# Altium schematic sheet MA2400_P2_MODUAL.SchDoc
size A4
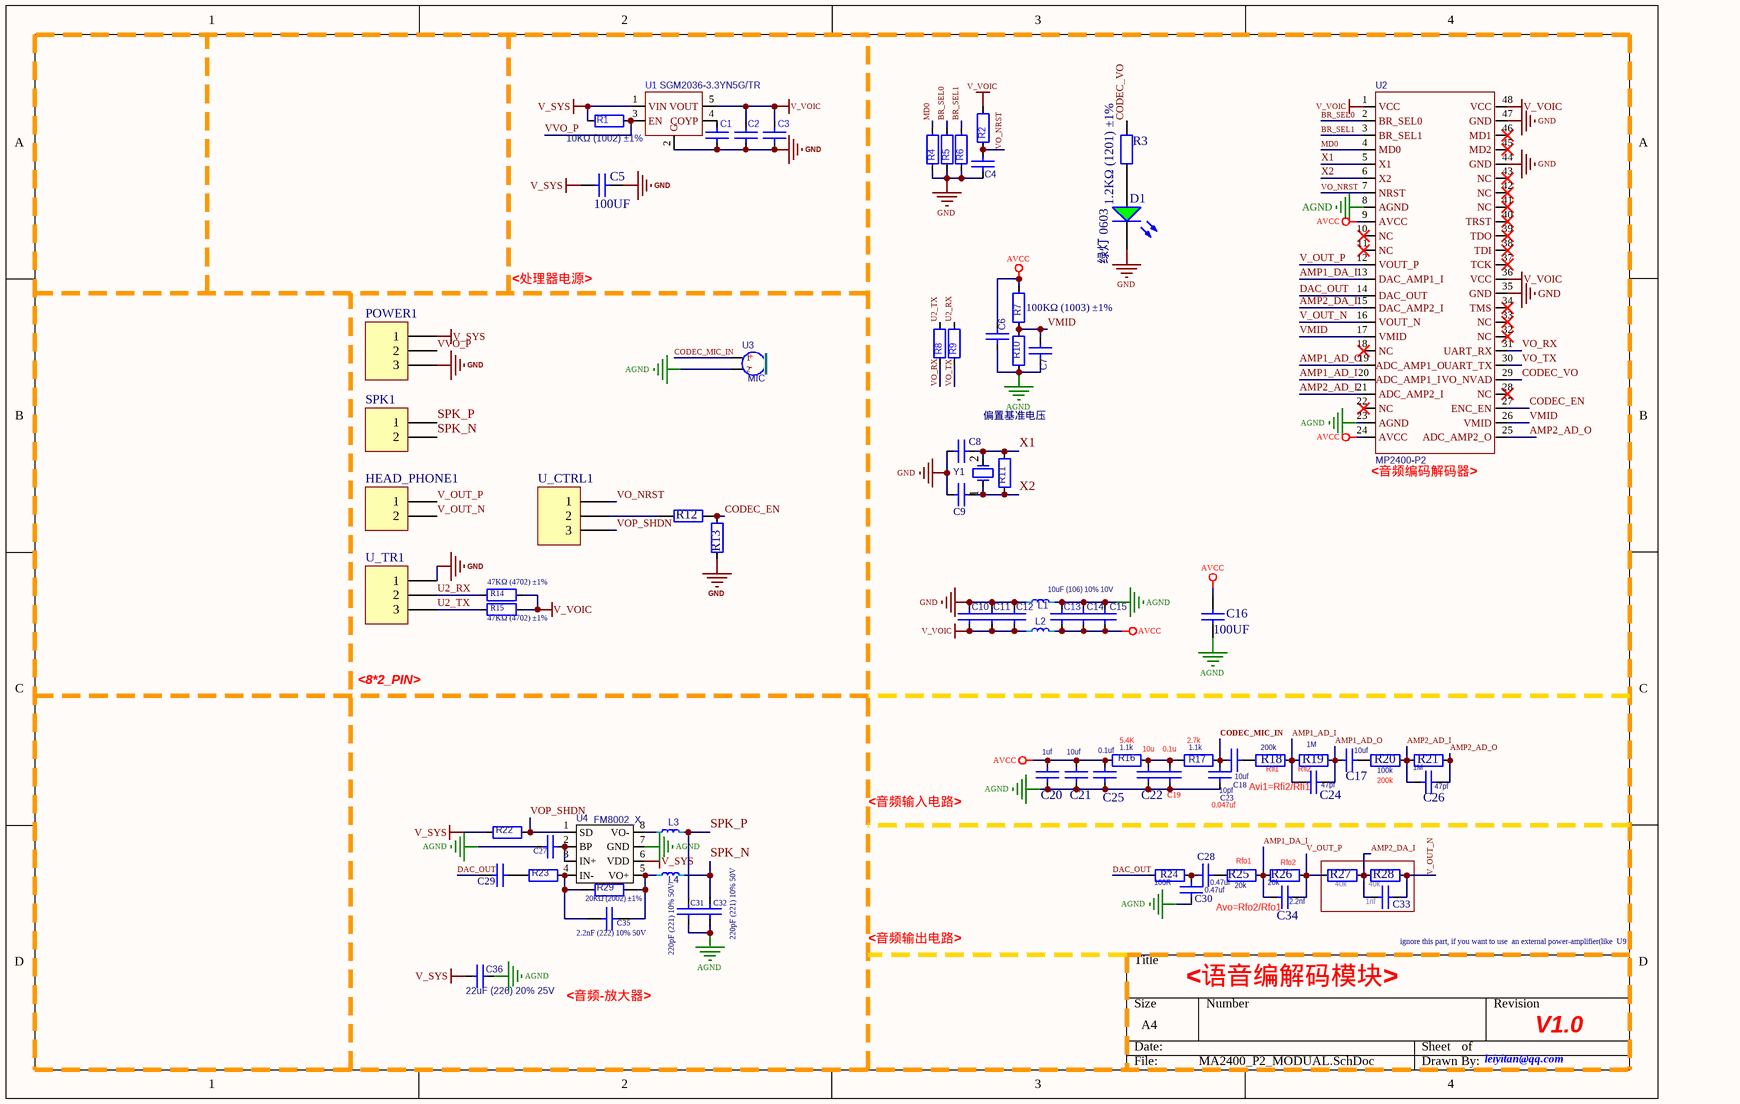
[diagram p0: MA2400_P2_MODUAL.SchDoc]

## Parts
C1  100nF (104) 10% 16V  [0402_C]  (value not drawn)
C2  100nF (104) 10% 16V  [0402_C]  (value not drawn)
C3  10uF (106) 10% 10V  [0603_C]  (value not drawn)
C4  10uF (106) 20% 6.3V  [0402_C]  (value not drawn)
C5  100UF  [C1210]
C6  1.0uF (105) 10% 25V  [0402_C]  (value not drawn)
C7  1.0uF (105) 10% 25V  [0402_C]  (value not drawn)
C8  12pF (120) 5% 50V  [0603_C]  (value not drawn)
C9  12pF (120) 5% 50V  [0603_C]  (value not drawn)
C10  100nF (104) 10% 16V  [0402_C]  (value not drawn)
C11  100nF (104) 10% 16V  [0402_C]  (value not drawn)
C12  100nF (104) 10% 16V  [0402_C]  (value not drawn)
C13  10uF (106) 10% 10V  [0603_C]
C14  100nF (104) 10% 16V  [0402_C]  (value not drawn)
C15  100nF (104) 10% 16V  [0402_C]  (value not drawn)
C16  100UF  [C1210]
C17  10uF (106) 10% 25V  [0805_C]  (value not drawn)
C18  10uF (106) 10% 25V  [0805_C]  (value not drawn)
C19  47nF (473) 10% 50V  [0805_C]  (value not drawn)
C20  1uF (105) 10% 50V  [0805_C]  (value not drawn)
C21  10uF (106) 10% 25V  [0805_C]  (value not drawn)
C22  47nF (473) 10% 50V  [0805_C]  (value not drawn)
C23  10pF (100) 5% 50V  [0603_C]  (value not drawn)
C24  47pF (470) 5% 50V  [0805_C]  (value not drawn)
C25  100nF(104) 10% 50V  [0805_C]  (value not drawn)
C26  47pF (470) 5% 50V  [0805_C]  (value not drawn)
C27  1uF (105) 10% 50V  [0805_C]  (value not drawn)
C28  470nF (474) 10% 50V  [0805_C]  (value not drawn)
C29  470nF (474) 10% 50V  [0805_C]  (value not drawn)
C30  470nF (474) 10% 50V  [0805_C]  (value not drawn)
C31  220pF (221) 10% 50V  [0402_C]
C32  220pF (221) 10% 50V  [0402_C]
C33  1nF (102) 10% 50V  [0805_C]  (value not drawn)
C34  2.2nF (222) 5% 50V  [0805_C]  (value not drawn)
C35  2.2nF (222) 10% 50V  [0603_C]
C36  22uF (226) 20% 25V  [0805_C]
D1  绿灯 0603  [0603_LED_S1]
HEAD_PHONE1  (no value)  [HDR1X2]
L1  10uH ±10%  [0603_L]  (value not drawn)
L2  10uH ±10%  [0603_L]  (value not drawn)
L3  10uH ±10%  [0603_L]  (value not drawn)
L4  10uH ±10%  [0603_L]  (value not drawn)
POWER1  (no value)  [HDR1X3]
R1  10KΩ (1002) ±1%  [0402_R]
R2  10KΩ (1002) ±1%  [0402_R]  (value not drawn)
R3  1.2KΩ (1201) ±1%  [0402_R]
R4  10KΩ (1002) ±1%  [0402_R]  (value not drawn)
R5  10KΩ (1002) ±1%  [0402_R]  (value not drawn)
R6  10KΩ (1002) ±1%  [0402_R]  (value not drawn)
R7  100KΩ (1003) ±1%  [0402_R]
R8  10KΩ (1002) ±1%  [0402_R]  (value not drawn)
R9  10KΩ (1002) ±1%  [0402_R]  (value not drawn)
R10  100KΩ (1003) ±1%  [0402_R]  (value not drawn)
R11  1MΩ (1004) ±1%  [0402_R]  (value not drawn)
R12  1KΩ (1001) ±1%  [0402_R]  (value not drawn)
R13  10KΩ (1002) ±1%  [0402_R]  (value not drawn)
R14  47KΩ (4702) ±1%  [0402_R]
R15  47KΩ (4702) ±1%  [0402_R]
R16  1.1KΩ (1101) ±1%  [0603_R]  (value not drawn)
R17  1.1KΩ (1101) ±1%  [0603_R]  (value not drawn)
R18  200KΩ (2003) ±1%  [0805_R]  (value not drawn)
R19  1MΩ (1004) ±1%  [0805_R]  (value not drawn)
R20  100KΩ (1003) ±1%  [0805_R]  (value not drawn)
R21  1MΩ (1004) ±1%  [0805_R]  (value not drawn)
R22  10KΩ (1002) ±1%  [0402_R]  (value not drawn)
R23  20KΩ (2002) ±1%  [0402_R]  (value not drawn)
R24  100Ω (1000) ±1%  [0805_R]  (value not drawn)
R25  20KΩ (2002) ±1%  [0805_R]  (value not drawn)
R26  20KΩ (2002) ±1%  [0805_R]  (value not drawn)
R27  40.2KΩ (4022) ±1%  [0805_R]  (value not drawn)
R28  40.2KΩ (4022) ±1%  [0805_R]  (value not drawn)
R29  20KΩ (2002) ±1%  [0402_R]
SPK1  (no value)  [HDR1X2]
U1  SGM2036-3.3YN5G/TR  [SOT23-5]
U2  MP2400-P2  [LQFP-48_7x7x05P]
U3  MIC  [6022_MIC]
U4  FM8002_X  [SOP-8_150mil]
U_CTRL1  (no value)  [HDR1X3]
U_TR1  (no value)  [HDR1X3]
Y1  8MHz ±20ppm 20pF  [SMD-5032_2P]  (value not drawn)

## Nets
AGND: C6.1 C7.1 C13.2 C14.2 C15.2 C16.1 C19.1 C20.1 C21.1 C22.1 C23.1 C25.1 C27.1 C30.1 C31.1 C32.1 C36.2 L1.1 R10.1 U2.8(AGND) U2.23(AGND) U3.2 U4.7(GND)
AVCC: C6.2 C13.1 C14.1 C15.1 C16.2 C20.2 C21.2 C25.2 L2.1 R7.2 R16.1 U2.9(AVCC) U2.24(AVCC)
GND: C1.1 C2.1 C3.1 C4.1 C5.2 C8.1 C9.2 C10.2 C11.2 C12.2 D1.K L1.2 POWER1.3 R4.1 R5.1 R6.1 R13.2 U1.2(G) U2.35(GND) U2.44(GND) U2.47(GND) U_TR1.1
V_SYS: C5.1 C36.1 POWER1.1 R1.1 R22.1 U1.1(VIN) U4.6(VDD)
V_VOIC: C2.2 C3.2 C10.1 C11.1 C12.1 L2.2 R2.2 R14.2 R15.2 U1.5(VOUT) U2.1(VCC) U2.36(VCC) U2.48(VCC)
AMP1_AD_I: C24.1 R18.2 R19.1 U2.20(ADC_AMP1_I)
AMP1_AD_O: C17.2 C24.2 R19.2 U2.19(ADC_AMP1_O)
AMP1_DA_I: C34.2 R25.2 R26.1 U2.13(DAC_AMP1_I)
AMP2_AD_I: C26.1 R20.2 R21.1 U2.21(ADC_AMP2_I)
AMP2_AD_O: C26.2 R21.2 U2.25(ADC_AMP2_O)
AMP2_DA_I: C33.1 R27.2 R28.1 U2.15(DAC_AMP2_I)
BR_SEL0: R5.2 U2.2(BR_SEL0)
BR_SEL1: R6.2 U2.3(BR_SEL1)
CODEC_EN: R12.2 R13.1 U2.27(ENC_EN)
CODEC_MIC_IN: C18.2 C23.2 R17.2 U3.1
CODEC_VO: R3.2 U2.29(VO_NVAD)
DAC_OUT: C29.1 R24.1 U2.14(DAC_OUT)
MD0: R4.2 U2.4(MD0)
SPK_N: C32.2 L4.1 SPK1.2
SPK_P: C31.2 L3.1 SPK1.1
U2_RX: R9.2 R14.1 U_TR1.2
U2_TX: R8.2 R15.1 U_TR1.3
V_OUT_N: C33.2 HEAD_PHONE1.2 R28.2 U2.16(VOUT_N)
V_OUT_P: C34.1 HEAD_PHONE1.1 R26.2 R27.1 U2.12(VOUT_P)
VMID: C7.2 R7.1 R10.2 U2.17(VMID) U2.26(VMID)
VO_NRST: C4.2 R2.1 U2.7(NRST) U_CTRL1.1
VO_RX: R8.1 U2.31(UART_RX)
VO_TX: R9.1 U2.30(UART_TX)
VOP_SHDN: R22.2 U4.1(SD) U_CTRL1.3
VVO_P: POWER1.2 R1.2 U1.3(EN)
X1: C8.2 R11.2 U2.5(X1) Y1.2(OSC2)
X2: C9.1 R11.1 U2.6(X2) Y1.1(OSC1)
NetC1_2: C1.2 U1.4(COYP)
NetC17_1: C17.1 R20.1
NetC18_1: C18.1 R18.1
NetC19_2: C19.2 C22.2 R16.2 R17.1
NetC27_2: C27.2 U4.2(BP) U4.3(IN+)
NetC28_1: C28.1 C30.2 R24.2
NetC28_2: C28.2 R25.1
NetC29_2: C29.2 R23.1
NetC35_1: C35.1 R23.2 R29.1 U4.4(IN-)
NetC35_2: C35.2 L4.2 R29.2 U4.5(VO+)
NetD1_A: D1.A R3.1
NetL3_2: L3.2 U4.8(VO-)
NetR12_1: R12.1 U_CTRL1.2

Not connected (* = marked no-connect by the designer): U2 10(NC)* 11(NC)* 18(NC)* 22(NC)* 28(NC)* 32(NC)* 33(NC)* 34(TMS)* 37(TCK)* 38(TDI)* 39(TDO)* 40(TRST)* 41(NC)* 42(NC)* 43(NC)* 45(MD2)* 46(MD1)*

## Notes on the sheet
- <处理器电源>
- 偏置基准电压
- (near U2) <音频编码解码器>
- <8*2_PIN>
- (near C20) 1uf
- (near C21) 10uf
- (near R16) 0.1uf
- (near R16) 1.1k
- 5.4K
- 10u
- 0.1u
- (near R17) 2.7k
- (near R17) 1.1k
- (near R18) 200k
- (near R19) 1M
- 10uf
- 1M
- <音频输入电路>
- (near C23) 0.047uf
- (near C23) 10pf
- (near C24) Avi1=Rfi2/Rfi1
- (near R18) Rfi1
- Rfi2
- (near C24) 47pf
- (near R20) 100k
- 200k
- (near C26) 47pf
- (near R24) 100R
- 0.47uf
- (near C34) Avo=Rfo2/Rfo1
- (near R25) 20k
- (near R25) Rfo1
- 20k
- (near R26) Rfo2
- (near C34) 2.2nf
- (near R27) 40k
- (near C33) 1nf
- 40k
- <音频输出电路>
- ignore this part, if you want to use  an external power-amplifier(like  U9
- <音频-放大器>
- <语音编解码模块>
- V1.0
- leiyitan@qq.com
- (in symbol MIC) +; -

## Library data of the parts
C1 C2 C10-C12 C14 C15 = 0402 100nF (104) 10% 16V: 贴片电容; ComponentLink1Description: 供应商链接; ComponentLink1URL: http://www.szlcsc.com/product/details_1877.html; Package: 0402; Supplier: LC; SuppliersPartNumber: C1525
C3 C13 = 0603 10uF (106) 10% 10V: 贴片电容; ComponentLink1Description: 供应商链接; ComponentLink1URL: http://www.szlcsc.com/product/details_20411.html; Package: 0603; Supplier: LC; SuppliersPartNumber: C19702
C4 = 0402 10uF (106) 20% 6.3V: 贴片电容; ComponentLink1Description: 供应商链接; ComponentLink1URL: http://www.szlcsc.com/product/details_16204.html; Package: 0402; Supplier: LC; SuppliersPartNumber: C15525
C5 C16 = 1206 10uF (106) 10% 50V: 贴片钽电容
C6 C7 = 0402 1.0uF (105) 10% 25V: 贴片电容; ComponentLink1Description: 供应商链接; ComponentLink1URL: http://www.szlcsc.com/product/details_53938.html; Package: 0402; Supplier: LC; SuppliersPartNumber: C52923
C8 C9 = 0603 12pF (120) 5% 50V: 贴片电容; ComponentLink1Description: 供应商链接; ComponentLink1URL: http://www.szlcsc.com/product/details_39506.html; Package: 0603; Supplier: LC; SuppliersPartNumber: C38523
C17 C18 C21 = 0805 10uF (106) 10% 25V: 贴片电容; ComponentLink1Description: 供应商链接; ComponentLink1URL: http://www.szlcsc.com/product/details_16532.html; Package: 0805; Supplier: LC; SuppliersPartNumber: C15850
C19 C22 = 0805 47nF (473) 10% 50V: 贴片电容; ComponentLink1Description: 供应商链接; ComponentLink1URL: http://www.szlcsc.com/product/details_54150.html; Package: 0805; Supplier: LC; SuppliersPartNumber: C53134
C20 C27 = 0805 1uF (105) 10% 50V: 贴片电容; ComponentLink1Description: 供应商链接; ComponentLink1URL: http://www.szlcsc.com/product/details_29074.html; Package: 0805; Supplier: LC; SuppliersPartNumber: C28323
C23 = 0603 10pF (100) 5% 50V: 贴片电容; ComponentLink1Description: 供应商链接; ComponentLink1URL: http://www.szlcsc.com/product/details_1986.html; Package: 0603; Supplier: LC; SuppliersPartNumber: C1634
C24 C26 = 0805 47pF (470) 5% 50V: 贴片电容; ComponentLink1Description: 供应商链接; ComponentLink1URL: http://www.szlcsc.com/product/details_15529.html; Package: 0805; Supplier: LC; SuppliersPartNumber: C14857
C25 = 0805 100nF(104) 10% 50V: 贴片电容; ComponentLink1Description: 供应商链接; ComponentLink1URL: http://www.szlcsc.com/product/details_50686.html; Package: 0805; Supplier: LC; SuppliersPartNumber: C49678
C28-C30 = 0805 470nF (474) 10% 50V: 贴片电容; ComponentLink1Description: 供应商链接; ComponentLink1URL: http://www.szlcsc.com/product/details_14623.html; Package: 0805; Supplier: LC; SuppliersPartNumber: C13967
C31 C32 = 0402 220pF (221) 10% 50V: 贴片电容; ComponentLink1Description: 供应商链接; ComponentLink1URL: http://www.szlcsc.com/product/details_1882.html; Package: 0402; Supplier: LC; SuppliersPartNumber: C1530
C33 = 0805 1nF (102) 10% 50V: 贴片电容; ComponentLink1Description: 供应商链接; ComponentLink1URL: http://www.szlcsc.com/product/details_52223.html; Package: 0805; Supplier: LC; SuppliersPartNumber: C51210
C34 = 0805 2.2nF (222) 5% 50V: 贴片电容; ComponentLink1Description: 供应商链接; ComponentLink1URL: http://www.szlcsc.com/product/details_29010.html; Package: 0805; Supplier: LC; SuppliersPartNumber: C28260
C35 = 0603 2.2nF (222) 10% 50V: 贴片电容; ComponentLink1Description: 供应商链接; ComponentLink1URL: http://www.szlcsc.com/product/details_1956.html; Package: 0603; Supplier: LC; SuppliersPartNumber: C1604
C36 = 0805 22uF (226) 20% 25V: 贴片电容; ComponentLink1Description: 供应商链接; ComponentLink1URL: http://www.szlcsc.com/product/details_46786.html; Package: 0805; Supplier: LC; SuppliersPartNumber: C45783
D1 = 0603 绿灯: 发光二极管; ComponentLink1Description: 供应商链接; ComponentLink1URL: http://www.szlcsc.com/product/details_73152.html; Package: 0603; Supplier: LC; SuppliersPartNumber: C72043
HEAD_PHONE1 SPK1 = Header 2: Header, 2-Pin; LatestRevisionDate: 17-Jul-2002; LatestRevisionNote: Re-released for DXP Platform.; Publisher: Altium Limited
L1-L4 = BEAD: 贴片电感; ComponentLink1Description: 供应商链接; ComponentLink1URL: http://www.szlcsc.com/product/details_1387.html; Package: 0603; Supplier: LC; SuppliersPartNumber: C1035
POWER1 U_CTRL1 U_TR1 = Header 3: Header, 3-Pin; LatestRevisionDate: 17-Jul-2002; LatestRevisionNote: Re-released for DXP Platform.; Publisher: Altium Limited
R1 R2 R4-R6 R8 R9 R13 R22 = 0402 10KΩ (1002) 1%: 贴片电阻; ComponentLink1Description: 供应商链接; ComponentLink1URL: http://www.szlcsc.com/product/details_26487.html; Package: 0402; Supplier: LC; SuppliersPartNumber: C25744
R3 = 0402 1.2KΩ (1201) 1%: 贴片电阻; ComponentLink1Description: 供应商链接; ComponentLink1URL: http://www.szlcsc.com/product/details_26605.html; Package: 0402; Supplier: LC; SuppliersPartNumber: C25862
R7 R10 = 0402 100KΩ (1003) 1%: 贴片电阻; ComponentLink1Description: 供应商链接; ComponentLink1URL: http://www.szlcsc.com/product/details_26484.html; Package: 0402; Supplier: LC; SuppliersPartNumber: C25741
R11 = 0402 1MΩ (1004) 1%: 贴片电阻; ComponentLink1Description: 供应商链接; ComponentLink1URL: http://www.szlcsc.com/product/details_26826.html; Package: 0402; Supplier: LC; SuppliersPartNumber: C26083
R12 = 0402 1KΩ (1001) 1%: 贴片电阻; ComponentLink1Description: 供应商链接; ComponentLink1URL: http://www.szlcsc.com/product/details_12256.html; Package: 0402; Supplier: LC; SuppliersPartNumber: C11702
R14 R15 = 0402 47KΩ (4702) 1%: 贴片电阻; ComponentLink1Description: 供应商链接; ComponentLink1URL: http://www.szlcsc.com/product/details_26535.html; Package: 0402; Supplier: LC; SuppliersPartNumber: C25792
R16 R17 = 0603 1.1KΩ (1101) 1%: 贴片电阻; ComponentLink1Description: 供应商链接; ComponentLink1URL: http://www.szlcsc.com/product/details_23491.html; Package: 0603; Supplier: LC; SuppliersPartNumber: C22764
R18 = 0805 200KΩ (2003) 1%: 贴片电阻; ComponentLink1Description: 供应商链接; ComponentLink1URL: http://www.szlcsc.com/product/details_18227.html; Package: 0805; Supplier: LC; SuppliersPartNumber: C17539
R19 R21 = 0805 1MΩ (1004) 1%: 贴片电阻; ComponentLink1Description: 供应商链接; ComponentLink1URL: http://www.szlcsc.com/product/details_18202.html; Package: 0805; Supplier: LC; SuppliersPartNumber: C17514
R20 = 0805 100KΩ (1003) 1%: 贴片电阻; ComponentLink1Description: 供应商链接; ComponentLink1URL: http://www.szlcsc.com/product/details_18095.html; Package: 0805; Supplier: LC; SuppliersPartNumber: C17407
R23 R29 = 0402 20KΩ (2002) 1%: 贴片电阻; ComponentLink1Description: 供应商链接; ComponentLink1URL: http://www.szlcsc.com/product/details_26508.html; Package: 0402; Supplier: LC; SuppliersPartNumber: C25765
R24 = 0805 100Ω (1000) 1%: 贴片电阻; ComponentLink1Description: 供应商链接; ComponentLink1URL: http://www.szlcsc.com/product/details_18096.html; Package: 0805; Supplier: LC; SuppliersPartNumber: C17408
R25 R26 = 0805 20KΩ (2002) 1%: 贴片电阻; ComponentLink1Description: 供应商链接; ComponentLink1URL: http://www.szlcsc.com/product/details_4735.html; Package: 0805; Supplier: LC; SuppliersPartNumber: C4328
R27 R28 = 0805 40.2KΩ (4022) 1%: 贴片电阻; ComponentLink1Description: 供应商链接; ComponentLink1URL: http://www.szlcsc.com/product/details_18366.html; Package: 0805; Supplier: LC; SuppliersPartNumber: C17678
U1 = LDO: 3.3 LDO; ComponentLink1Description: 供应商链接; ComponentLink1URL: http://item.szlcsc.com/93595.html; Package: SOT-23-5; Supplier: SGMICRO(圣邦微); SuppliersPartNumber: C92402
U2 = MP2400-P2: 音频处理器
U3 = MIC: 6022插针七级防水咪头7级防水麦克风咪头; ComponentLink1URL: https://item.taobao.com/item.htm?spm=a230r.1.14.39.1abf4e43mHUh4v&id=533899993907&ns=1&abbucket=17#detail; ComponentLink1Description: 供应商链接
U4 = FM8002_X: 音频放大器; ComponentLink1URL: http://item.szlcsc.com/95823.html; Package: SOP-8_150mil; SuppliersPartNumber: C94625; ComponentLink1Description: 供应商链接
Y1 = SMD-5032_2P 8MHz 20ppm 20pF: 贴片无源晶振/YSX530GA 8MHZ 20PF 10PPM -40~+85 编带; ComponentLink1Description: 供应商链接; ComponentLink1URL: http://item.szlcsc.com/117214.html; Package: SMD-5032_2P; Supplier: LC; SuppliersPartNumber: C115962